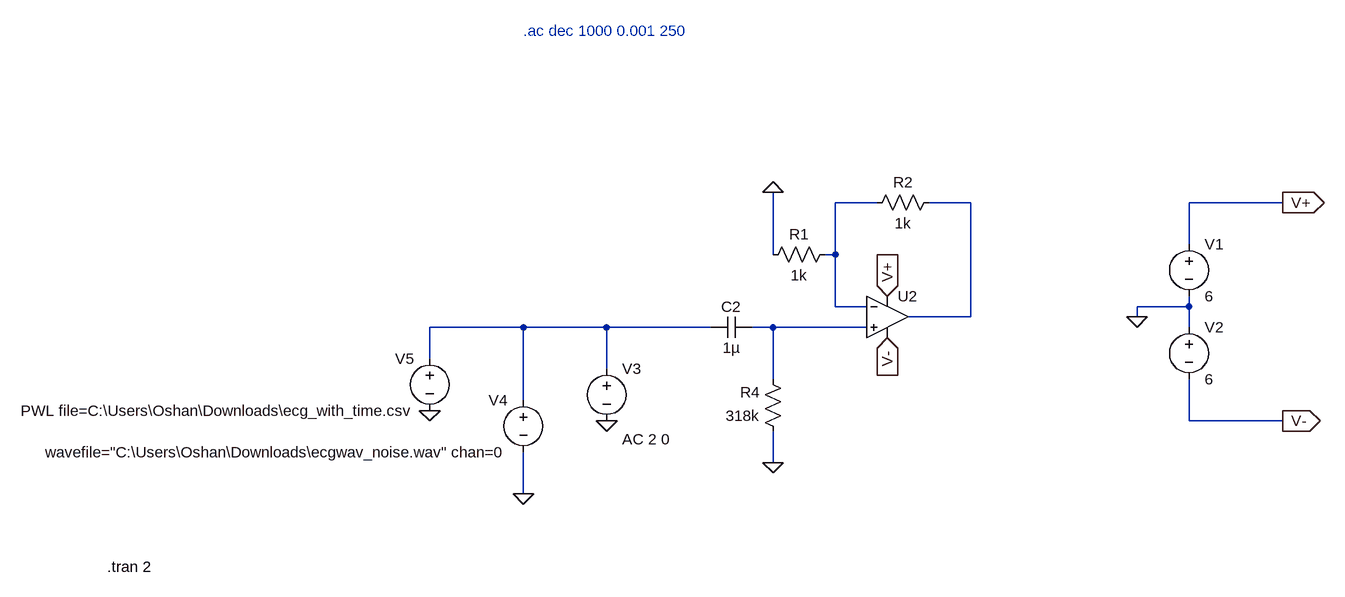
[diagram p0: schematic ecg_1HPF.asc]
ecg_1HPF.asc, the LTspice schematic file:
Version 4.1
SHEET 1 880 680
WIRE -80 -112 -144 -112
WIRE 64 -112 0 -112
WIRE 544 -112 400 -112
WIRE 400 -48 400 -112
WIRE -240 -32 -240 -128
WIRE -144 -32 -144 -112
WIRE -144 -32 -160 -32
WIRE -144 48 -144 -32
WIRE -96 48 -144 48
WIRE 400 48 400 32
WIRE 400 48 320 48
WIRE 64 64 64 -112
WIRE 64 64 -32 64
WIRE 320 64 320 48
WIRE -624 80 -768 80
WIRE -496 80 -624 80
WIRE -336 80 -496 80
WIRE -240 80 -272 80
WIRE -96 80 -240 80
WIRE 400 80 400 48
WIRE -768 128 -768 80
WIRE -496 144 -496 80
WIRE -240 160 -240 80
WIRE -624 192 -624 80
WIRE 400 224 400 160
WIRE 544 224 400 224
WIRE -240 288 -240 240
WIRE -624 336 -624 272
FLAG 320 64 0
FLAG 544 -112 V+
IOPIN 544 -112 Out
FLAG 544 224 V-
IOPIN 544 224 Out
FLAG -64 32 V+
IOPIN -64 32 In
FLAG -64 96 V-
IOPIN -64 96 In
FLAG -240 -128 0
FLAG -496 224 0
FLAG -240 288 0
FLAG -624 336 0
FLAG -768 208 0
SYMBOL voltage 400 -64 R0
WINDOW 123 0 0 Left 0
WINDOW 39 0 0 Left 0
SYMATTR InstName V1
SYMATTR Value 6
SYMBOL voltage 400 64 R0
WINDOW 123 0 0 Left 0
WINDOW 39 0 0 Left 0
SYMATTR InstName V2
SYMATTR Value 6
SYMBOL library\\lib\\sym\\ZZZ\\OpAmps\\UniversalOpamp2 -64 64 R0
SYMATTR InstName U2
SYMBOL cap -272 64 R90
WINDOW 0 0 32 VBottom 2
WINDOW 3 32 32 VTop 2
SYMATTR InstName C2
SYMATTR Value 1µ
SYMBOL res -144 -48 R90
WINDOW 0 0 56 VBottom 2
WINDOW 3 32 56 VTop 2
SYMATTR InstName R1
SYMATTR Value 1k
SYMBOL res 16 -128 R90
WINDOW 0 0 56 VBottom 2
WINDOW 3 32 56 VTop 2
SYMATTR InstName R2
SYMATTR Value 1k
SYMBOL res -224 256 R180
WINDOW 0 36 76 Left 2
WINDOW 3 36 40 Left 2
SYMATTR InstName R4
SYMATTR Value 318k
SYMBOL voltage -496 128 R0
WINDOW 123 24 124 Left 2
WINDOW 39 0 0 Left 0
SYMATTR Value2 AC 2 0
SYMATTR InstName V3
SYMATTR Value ""
SYMBOL voltage -624 176 M0
WINDOW 123 0 0 Left 0
WINDOW 39 0 0 Left 0
SYMATTR InstName V4
SYMATTR Value wavefile="C:\Users\Oshan\Downloads\ecgwav_noise.wav" chan=0
SYMBOL voltage -768 112 M0
WINDOW 123 0 0 Left 0
WINDOW 39 0 0 Left 0
SYMATTR InstName V5
SYMATTR Value PWL file=C:\Users\Oshan\Downloads\ecg_with_time.csv
TEXT -624 -376 Left 2 ;.ac dec 1000 0.001 250
TEXT -1264 448 Left 2 !.tran 2

The netlist it stands for:
* ecg_1HPF.asc
V1 V+ 0 6
V2 0 V- 6
X§U2 N004 N001 V+ V- N002 level.2 Avol=1Meg GBW=10Meg Slew=10Meg ilimit=25m rail=0 Vos=0 phimargin=45 en=0 enk=0 in=0 ink=0 Rin=500Meg  ; pins IN+ IN- V+ V- OUT
C2 N004 N003 1µ
R1 N001 0 1k
R2 N002 N001 1k
R4 0 N004 318k
V3 N003 0 AC 2 0
V4 N003 0 wavefile="C:\Users\Oshan\Downloads\ecgwav_noise.wav" chan=0
V5 N003 0 PWL file=C:\Users\Oshan\Downloads\ecg_with_time.csv
* .ac dec 1000 0.001 250
.tran 2
.lib UniversalOpamps2.sub
.backanno
.end